# Altium project 2002_CapteurMeteoWifi.PrjPcb
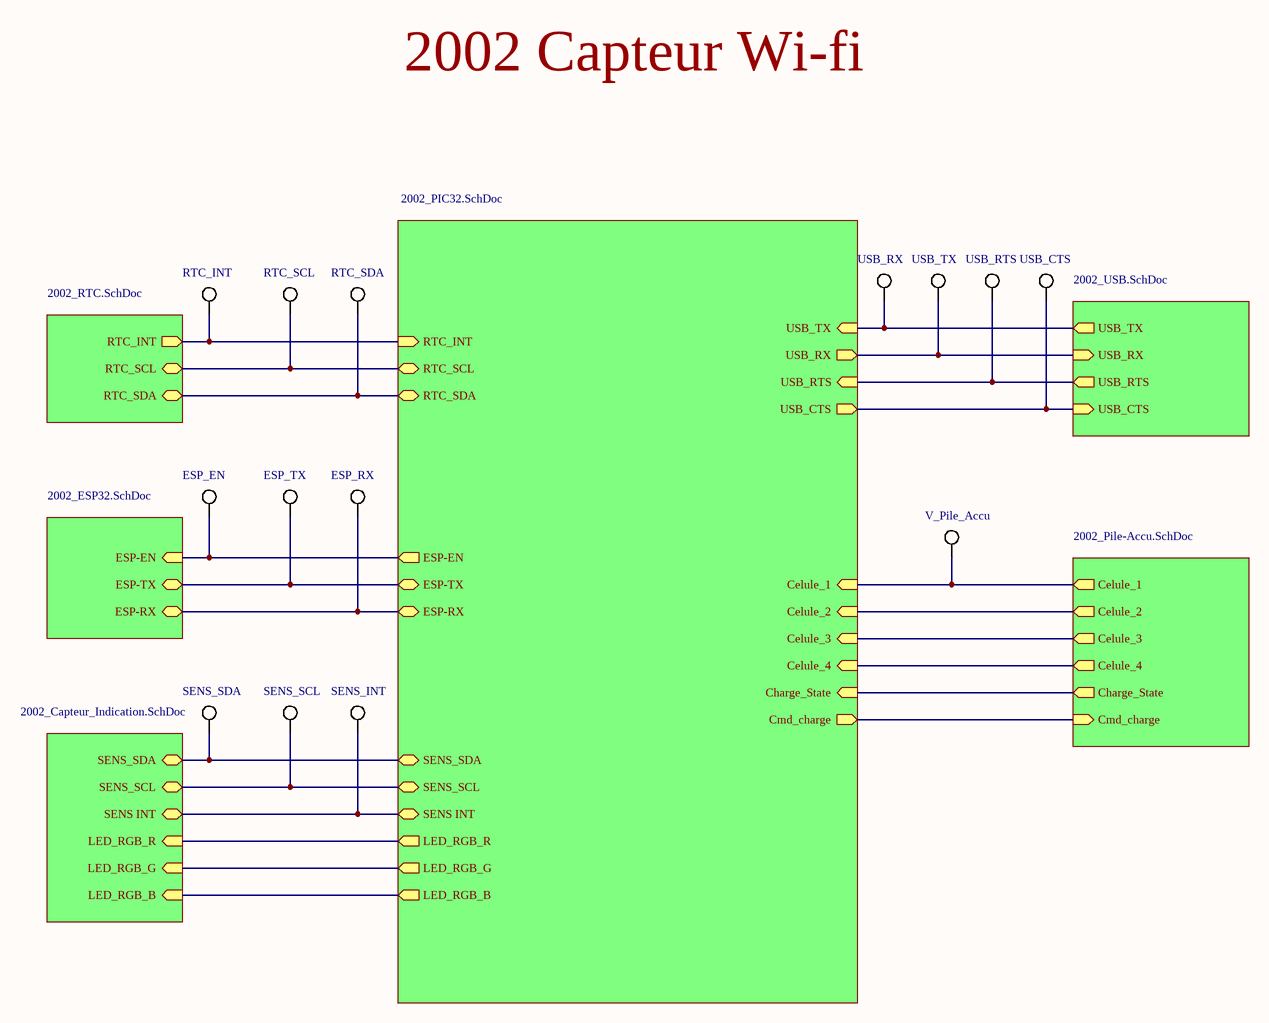
[diagram p0: 2002_SchemaBloc.SchDoc]
7 sheets, 88 parts. Net scope: hierarchical (ports join the sheet entries above them; power ports are global).
Board file: ES_PCB_6C_2L_2023.PcbDoc
Sheets:
  2002_SchemaBloc.SchDoc
    Puissance = 2002_USB.SchDoc
    Microcontrôleur = 2002_PIC32.SchDoc
    Ethernet = 2002_RTC.SchDoc
    Communication = 2002_Capteur_Indication.SchDoc
    ESP32 = 2002_ESP32.SchDoc
    Puissance = 2002_Pile-Accu.SchDoc

## Sheet 2002_SchemaBloc.SchDoc
size A3; Author: Joao Marques Chaves; Organization: ETML-ES; Address1: Avenue Recordon 1; Address2: 1004 Lausanne; Address3: Switzerland; SheetNumber: 1; SheetTotal: 7; Version: C

### Parts
ESP_EN  5019  [TESTPOINT_SMD]  (value not drawn)
ESP_RX  5019  [TESTPOINT_SMD]  (value not drawn)
ESP_TX  5019  [TESTPOINT_SMD]  (value not drawn)
RTC_INT  5019  [TESTPOINT_SMD]  (value not drawn)
RTC_SCL  5019  [TESTPOINT_SMD]  (value not drawn)
RTC_SDA  5019  [TESTPOINT_SMD]  (value not drawn)
SENS_INT  5019  [TESTPOINT_SMD]  (value not drawn)
SENS_SCL  5019  [TESTPOINT_SMD]  (value not drawn)
SENS_SDA  5019  [TESTPOINT_SMD]  (value not drawn)
USB_CTS  5019  [TESTPOINT_SMD]  (value not drawn)
USB_RTS  5019  [TESTPOINT_SMD]  (value not drawn)
USB_RX  5019  [TESTPOINT_SMD]  (value not drawn)
USB_TX  5019  [TESTPOINT_SMD]  (value not drawn)
V_Pile_Accu  5019  [TESTPOINT_SMD]  (value not drawn)

### Sub-sheets
Communication = 2002_Capteur_Indication.SchDoc: SENS_SDA (bidir), SENS_SCL (bidir), LED_RGB_R (in), LED_RGB_G (in), LED_RGB_B (in), SENS INT (bidir)
ESP32 = 2002_ESP32.SchDoc: ESP-RX (bidir), ESP-EN (in), ESP-TX (bidir)
Ethernet = 2002_RTC.SchDoc: RTC_SCL (bidir), RTC_SDA (bidir), RTC_INT (out)
Microcontrôleur = 2002_PIC32.SchDoc: RTC_SCL (bidir), RTC_SDA (bidir), ESP-EN (out), ESP-TX (bidir), ESP-RX (bidir), SENS_SDA (bidir), SENS_SCL (bidir), SENS INT (bidir), LED_RGB_R (out), LED_RGB_G (out), LED_RGB_B (out), USB_RX (out), USB_TX (in), USB_RTS (in), USB_CTS (out), Celule_1 (in), Celule_2 (in), Celule_3 (in), Celule_4 (in), RTC_INT (in), Charge_State (in), Cmd_charge (out)
Puissance = 2002_USB.SchDoc: USB_TX (out), USB_RX (in), USB_RTS (out), USB_CTS (in)
Puissance = 2002_Pile-Accu.SchDoc: Celule_1 (out), Celule_2 (out), Celule_3 (out), Celule_4 (out), Charge_State (out), Cmd_charge (in)

### Nets
Celule_1: V_Pile_Accu.1 ; sheet Microcontrôleur/Celule_1, sheet Puissance/Celule_1
Celule_2: sheet Microcontrôleur/Celule_2, sheet Puissance/Celule_2
Celule_3: sheet Microcontrôleur/Celule_3, sheet Puissance/Celule_3
Celule_4: sheet Microcontrôleur/Celule_4, sheet Puissance/Celule_4
Charge_State: sheet Microcontrôleur/Charge_State, sheet Puissance/Charge_State
Cmd_charge: sheet Microcontrôleur/Cmd_charge, sheet Puissance/Cmd_charge
ESP-EN: ESP_EN.1 ; sheet Microcontrôleur/ESP-EN, sheet ESP32/ESP-EN
ESP-RX: ESP_RX.1 ; sheet Microcontrôleur/ESP-RX, sheet ESP32/ESP-RX
ESP-TX: ESP_TX.1 ; sheet Microcontrôleur/ESP-TX, sheet ESP32/ESP-TX
LED_RGB_B: sheet Microcontrôleur/LED_RGB_B, sheet Communication/LED_RGB_B
LED_RGB_G: sheet Microcontrôleur/LED_RGB_G, sheet Communication/LED_RGB_G
LED_RGB_R: sheet Microcontrôleur/LED_RGB_R, sheet Communication/LED_RGB_R
RTC_INT: RTC_INT.1 ; sheet Microcontrôleur/RTC_INT, sheet Ethernet/RTC_INT
RTC_SCL: RTC_SCL.1 ; sheet Microcontrôleur/RTC_SCL, sheet Ethernet/RTC_SCL
RTC_SDA: RTC_SDA.1 ; sheet Microcontrôleur/RTC_SDA, sheet Ethernet/RTC_SDA
SENS INT: SENS_INT.1 ; sheet Microcontrôleur/SENS INT, sheet Communication/SENS INT
SENS_SCL: SENS_SCL.1 ; sheet Microcontrôleur/SENS_SCL, sheet Communication/SENS_SCL
SENS_SDA: SENS_SDA.1 ; sheet Microcontrôleur/SENS_SDA, sheet Communication/SENS_SDA
USB_CTS: USB_CTS.1 ; sheet Puissance/USB_CTS, sheet Microcontrôleur/USB_CTS
USB_RTS: USB_RTS.1 ; sheet Puissance/USB_RTS, sheet Microcontrôleur/USB_RTS
USB_RX: USB_TX.1 ; sheet Puissance/USB_RX, sheet Microcontrôleur/USB_RX
USB_TX: USB_RX.1 ; sheet Puissance/USB_TX, sheet Microcontrôleur/USB_TX

### Notes on the sheet
- 2002 Capteur Wi-fi
- Fichier :
- a
- Date :
- Heure :
- Version :
- Auteur :
- Modif.
- b
- c
- d
- Projet :
- No :
- Nb feuilles
- Feuille n°
- Chemin :

### Library data of the parts
ESP_EN ESP_RX ESP_TX RTC_INT RTC_SCL RTC_SDA SENS_INT SENS_SCL SENS_SDA USB_CTS USB_RTS USB_RX USB_TX V_Pile_Accu = TESTPOINT: Test point smd

## Sheet 2002_USB.SchDoc
size A3; Author: Joao Marques Chaves; Organization: ETML-ES; Address1: Avenue Recordon 1; Address2: 1004 Lausanne; Address3: Switzerland; SheetNumber: 2; SheetTotal: 7; Version: C
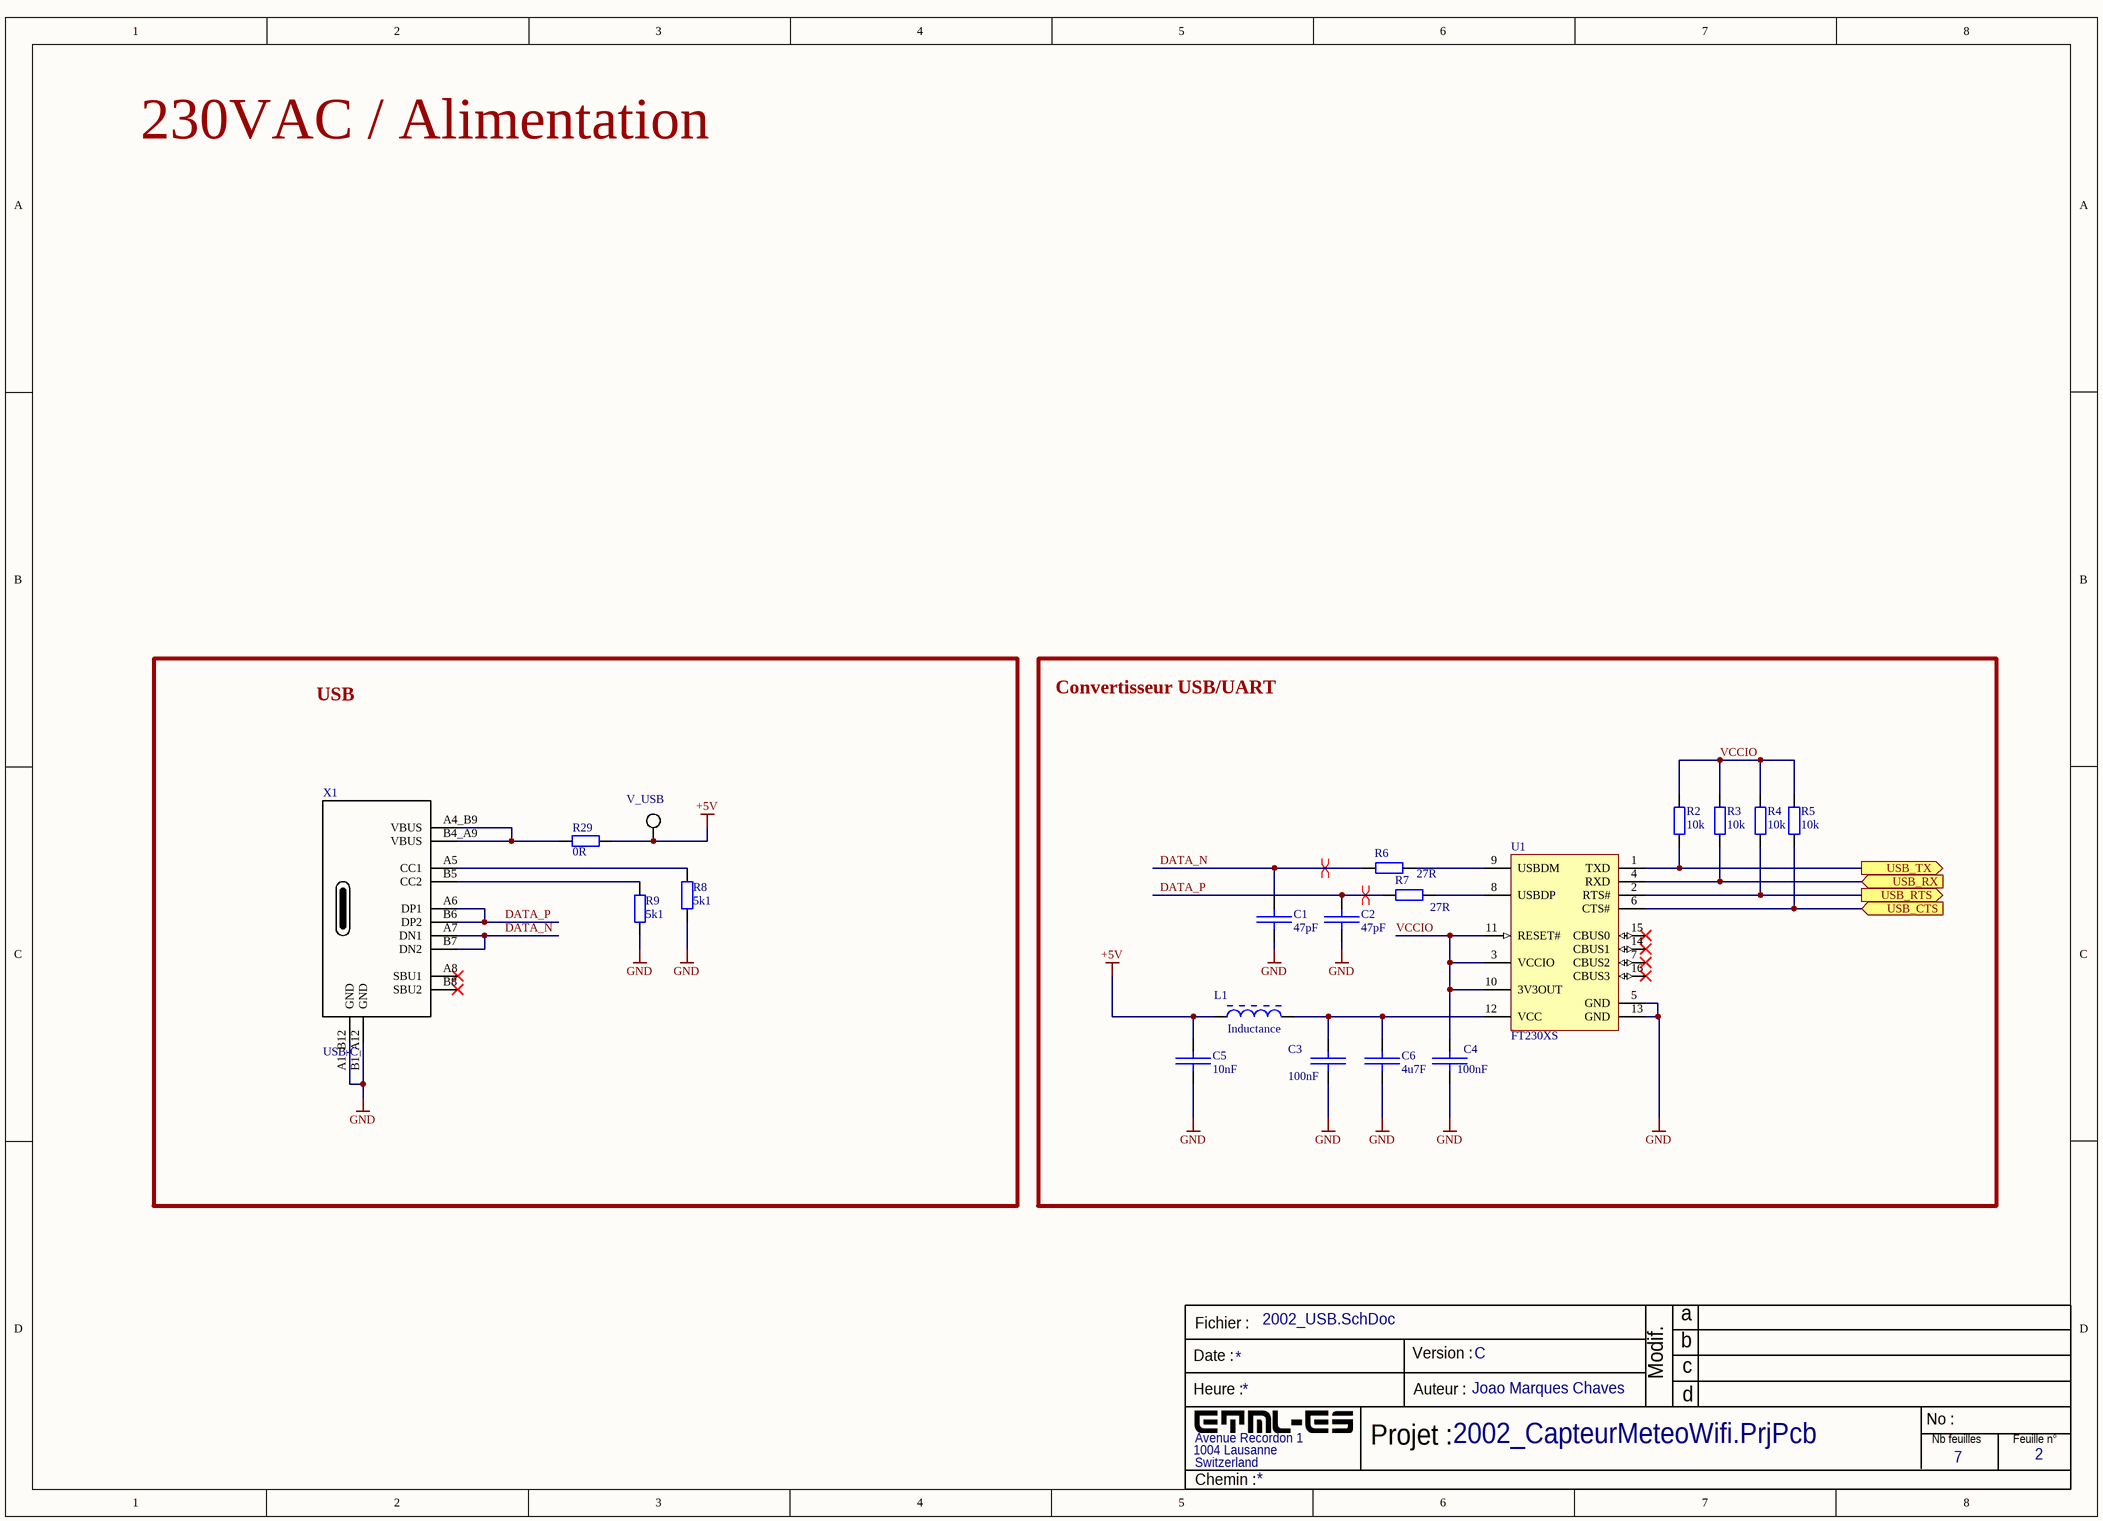
[diagram p1: 2002_USB.SchDoc]

### Parts
C1  47pF  [0805]
C2  47pF  [0805]
C3  100nF  [0805]
C4  100nF  [0805]
C5  10nF  [0805]
C6  4u7F  [0805]
L1  Inductance  [FB_MI0805K601R-10]
R2  10k  [0805]
R3  10k  [0805]
R4  10k  [0805]
R5  10k  [0805]
R6  27R  [0805]
R7  27R  [0805]
R8  5k1  [0805]
R9  5k1  [0805]
R29  0R  [0805]
U1  FT230XS  [FTDI-SSOP-16_L]
V_USB  5019  [TESTPOINT_SMD]  (value not drawn)
X1  USB-C  [GCT_USB4105-GF-A]

### Blocks framed on the sheet
USB: R8 R9 R29 V_USB X1
Convertisseur USB/UART: C1-C6 L1 R2-R7 U1

### Ports
USB_CTS (in), USB_RTS (out), USB_RX (in), USB_TX (out)

### Nets
+5V: C5.1 L1.1 R29.2 V_USB.1
GND: C1.2 C2.2 C3.2 C4.2 C5.2 C6.2 R8.1 R9.1 U1.5(GND) U1.13(GND) X1.A1_B12(GND) X1.B1_A12(GND)
DATA_N: C1.1 R6.1 X1.A7(DN1) X1.B7(DN2)
DATA_P: C2.1 R7.1 X1.A6(DP1) X1.B6(DP2)
USB_CTS: R5.1 U1.6(CTS#) ; port USB_CTS
USB_RTS: R4.1 U1.2(RTS#) ; port USB_RTS
USB_RX: R3.1 U1.4(RXD) ; port USB_RX
USB_TX: R2.1 U1.1(TXD) ; port USB_TX
VCCIO: C4.1 R2.2 R3.2 R4.2 R5.2 U1.3(VCCIO) U1.10(3V3OUT) U1.11(RESET#)
NetC3_1: C3.1 C6.1 L1.2 U1.12(VCC)
NetR6_2: R6.2 U1.9(USBDM)
NetR7_2: R7.2 U1.8(USBDP)
NetR8_2: R8.2 X1.A5(CC1)
NetR9_2: R9.2 X1.B5(CC2)
NetR29_1: R29.1 X1.A4_B9(VBUS) X1.B4_A9(VBUS)

Not connected (* = marked no-connect by the designer): U1 7(CBUS2)* 14(CBUS1)* 15(CBUS0)* 16(CBUS3)*; X1 A8(SBU1)* B8(SBU2)*

### Layout directives
differential pair: DATA_N, DATA_P

### Notes on the sheet
- 230VAC / Alimentation
- Fichier :
- a
- Date :
- Heure :
- Version :
- Auteur :
- Modif.
- b
- c
- d
- Projet :
- No :
- Nb feuilles
- Feuille n°
- Chemin :

### Library data of the parts
C1 C2 = Condensator: Value: 47pF
C3-C6 = Condensator: 0805 Condensator
  C3 C4: Value: 100nF
  C5: Value: 10nF
  C6: Value: 4u7F
L1 = CMP-2000-05196-1: MI0805K601R-10; Manufacturer: Laird; Filter Type: PowerLine; Current Rating (Max): 1.5A; Catalog Drawings: (HI,HZ,LI,MI)0805Series_1.10mmMax.Height; Impedance @ Frequency: 600Ohm@100MHz; Number of Lines: 1; DC Resistance (DCR) (Max): 100mOhm; Other Names: 240-2390-1; Kits: 240-2227-ND-KITEMIFERRITEBEADCHIPSMD; Online Catalog: MISeries; Standard Package: 1; Datasheet Version: Rev. A, 01/2004; Height (Max): 0.043"(1.10mm); Category: Filters; Operating Temperature: -40degC~125degC; Package Description: 2-Pin Surface Mount Device, Body 2 x 1.25 mm; Package / Case: 0805(2012Metric); Package Reference: MI0805K601R-10-2; Packaging: CutTape(CT); Ratings: -; Mounting Type: SurfaceMount; Datasheet URL: https://datasheet.ciiva.com/3082/mi0805k601r-10-a-vp-3082219.pdf; Size / Dimension: 0.079"Lx0.049"W(2.00mmx1.25mm); Family: FerriteBeadsandChips; Manufacturer URL: https://www.lairdtech.com; Series: MI; Supplier: Digikey; Supplier Ref.: 240-2390-1-ND; Supplier min. qty: 1; Supplier unit price: 0.11; ComponentLink1Description: distributeur; ComponentLink1URL: https://eu.mouser.com/ProductDetail/Laird-Performance-Materials/MI0805K601R-10?qs=bbdZqDPQhEXXIHxc191aOg%3D%3D; ComponentLink2Description: Datasheet; ComponentLink2URL: https://eu.mouser.com/datasheet/2/987/mi0805k601r_10_datasheet-2947150.pdf
R2-R5 = RES-0805: SMD Resistor; Resistance: 10k
R6 R7 = RES-0805: SMD Resistor 0805, 330Ω; Resistance: 27R
R8 R9 = CMP-2001-00528-1: Part Number: ERJ6ENF2703V; Manufacturer: Panasonic
R29 = Res2_1: Resistor; Published: 8-Jun-2000; LatestRevisionDate: 17-Jul-2002; LatestRevisionNote: Re-released for DXP Platform.; PackageReference: AXIAL-0.4; Publisher: Altium Limited; PackageDescription: Axial Device, Thru-Hole; 2 Leads; 0.4 in Pin Spacing; Value: 0R
U1 = CMP-2000-06288-1: USB to Basic UART IC, 2.97 to 5.5 V, -40 to 85 degC, 16-Pin SSOP, RoHS; Manufacturer: FTDI; Data Rate: 3Mbaud; USB Standard: USB2.0; USB Type: Transceiver; No. of Pins: 16Pins; Supply Voltage Max: 5.5V; SVHC: NoSVHC(17-Dec-2015); Supply Voltage Min: 2.97V; MSL: MSL3-168hours; Datasheet Version: Rev. 1.4, 05/2016; Interface Case Style: SSOP; Datasheet URL: http://www.ftdichip.com/Support/Documents/DataSheets/ICs/DS_FT230X.pdf; Packaging: CutTape; Package Description: 16-Pin Shrink Small Outline Package Integrated Circuit, Body 4.9 x 3.9 mm, Pitch 0.635 mm; Operating Temperature Min: -40°C; Mounting Technology: SurfaceMount; Package Reference: SSOP-16; Manufacturer URL: http://www.ftdichip.com/; Product Range: -; Operating Temperature Max: 85°C; No. of Ports: -; Supplier: Digikey; Supplier Ref.: 768-1135-1-ND; Supplier min. qty: 1; Supplier unit price: 2.00; ComponentLink1Description: distributeur; ComponentLink1URL: https://www.mouser.ch/ProductDetail/FTDI/FT230XS-R?qs=Gp1Yz1mis3XyCLeYOseSng%3D%3D; ComponentLink2Description: Datasheet; ComponentLink2URL: https://www.mouser.ch/datasheet/2/163/DS_FT230X-5395.pdf
V_USB = TESTPOINT: Test point smd
X1 = USB-C Type 2.0: U262-161N-4BVC11; ComponentLink1Description: LCSC  C319148; ComponentLink1URL: https://lcsc.com/product-detail/USB-Connectors_XKB-Connectivity-U262-161N-4BVC11_C319148.html; Supplier 1: LCSC; Supplier Part Number 1: C319148; ComponentLink2Description: Datasheet; ComponentLink2URL: https://eu.mouser.com/datasheet/2/837/Global_Connector_Technology_usb4105-3106202.pdf; ComponentLink3Description: distributeur; ComponentLink3URL: https://eu.mouser.com/ProductDetail/GCT/USB4105-GF-A?qs=KUoIvG%2F9IlY%2FMLlBMpStpA%3D%3D

## Sheet 2002_PIC32.SchDoc
size A3; Author: Joao Marques Chaves; Organization: ETML-ES; Address1: Avenue Recordon 1; Address2: 1004 Lausanne; Address3: Switzerland; SheetNumber: 4; SheetTotal: 7; Version: C
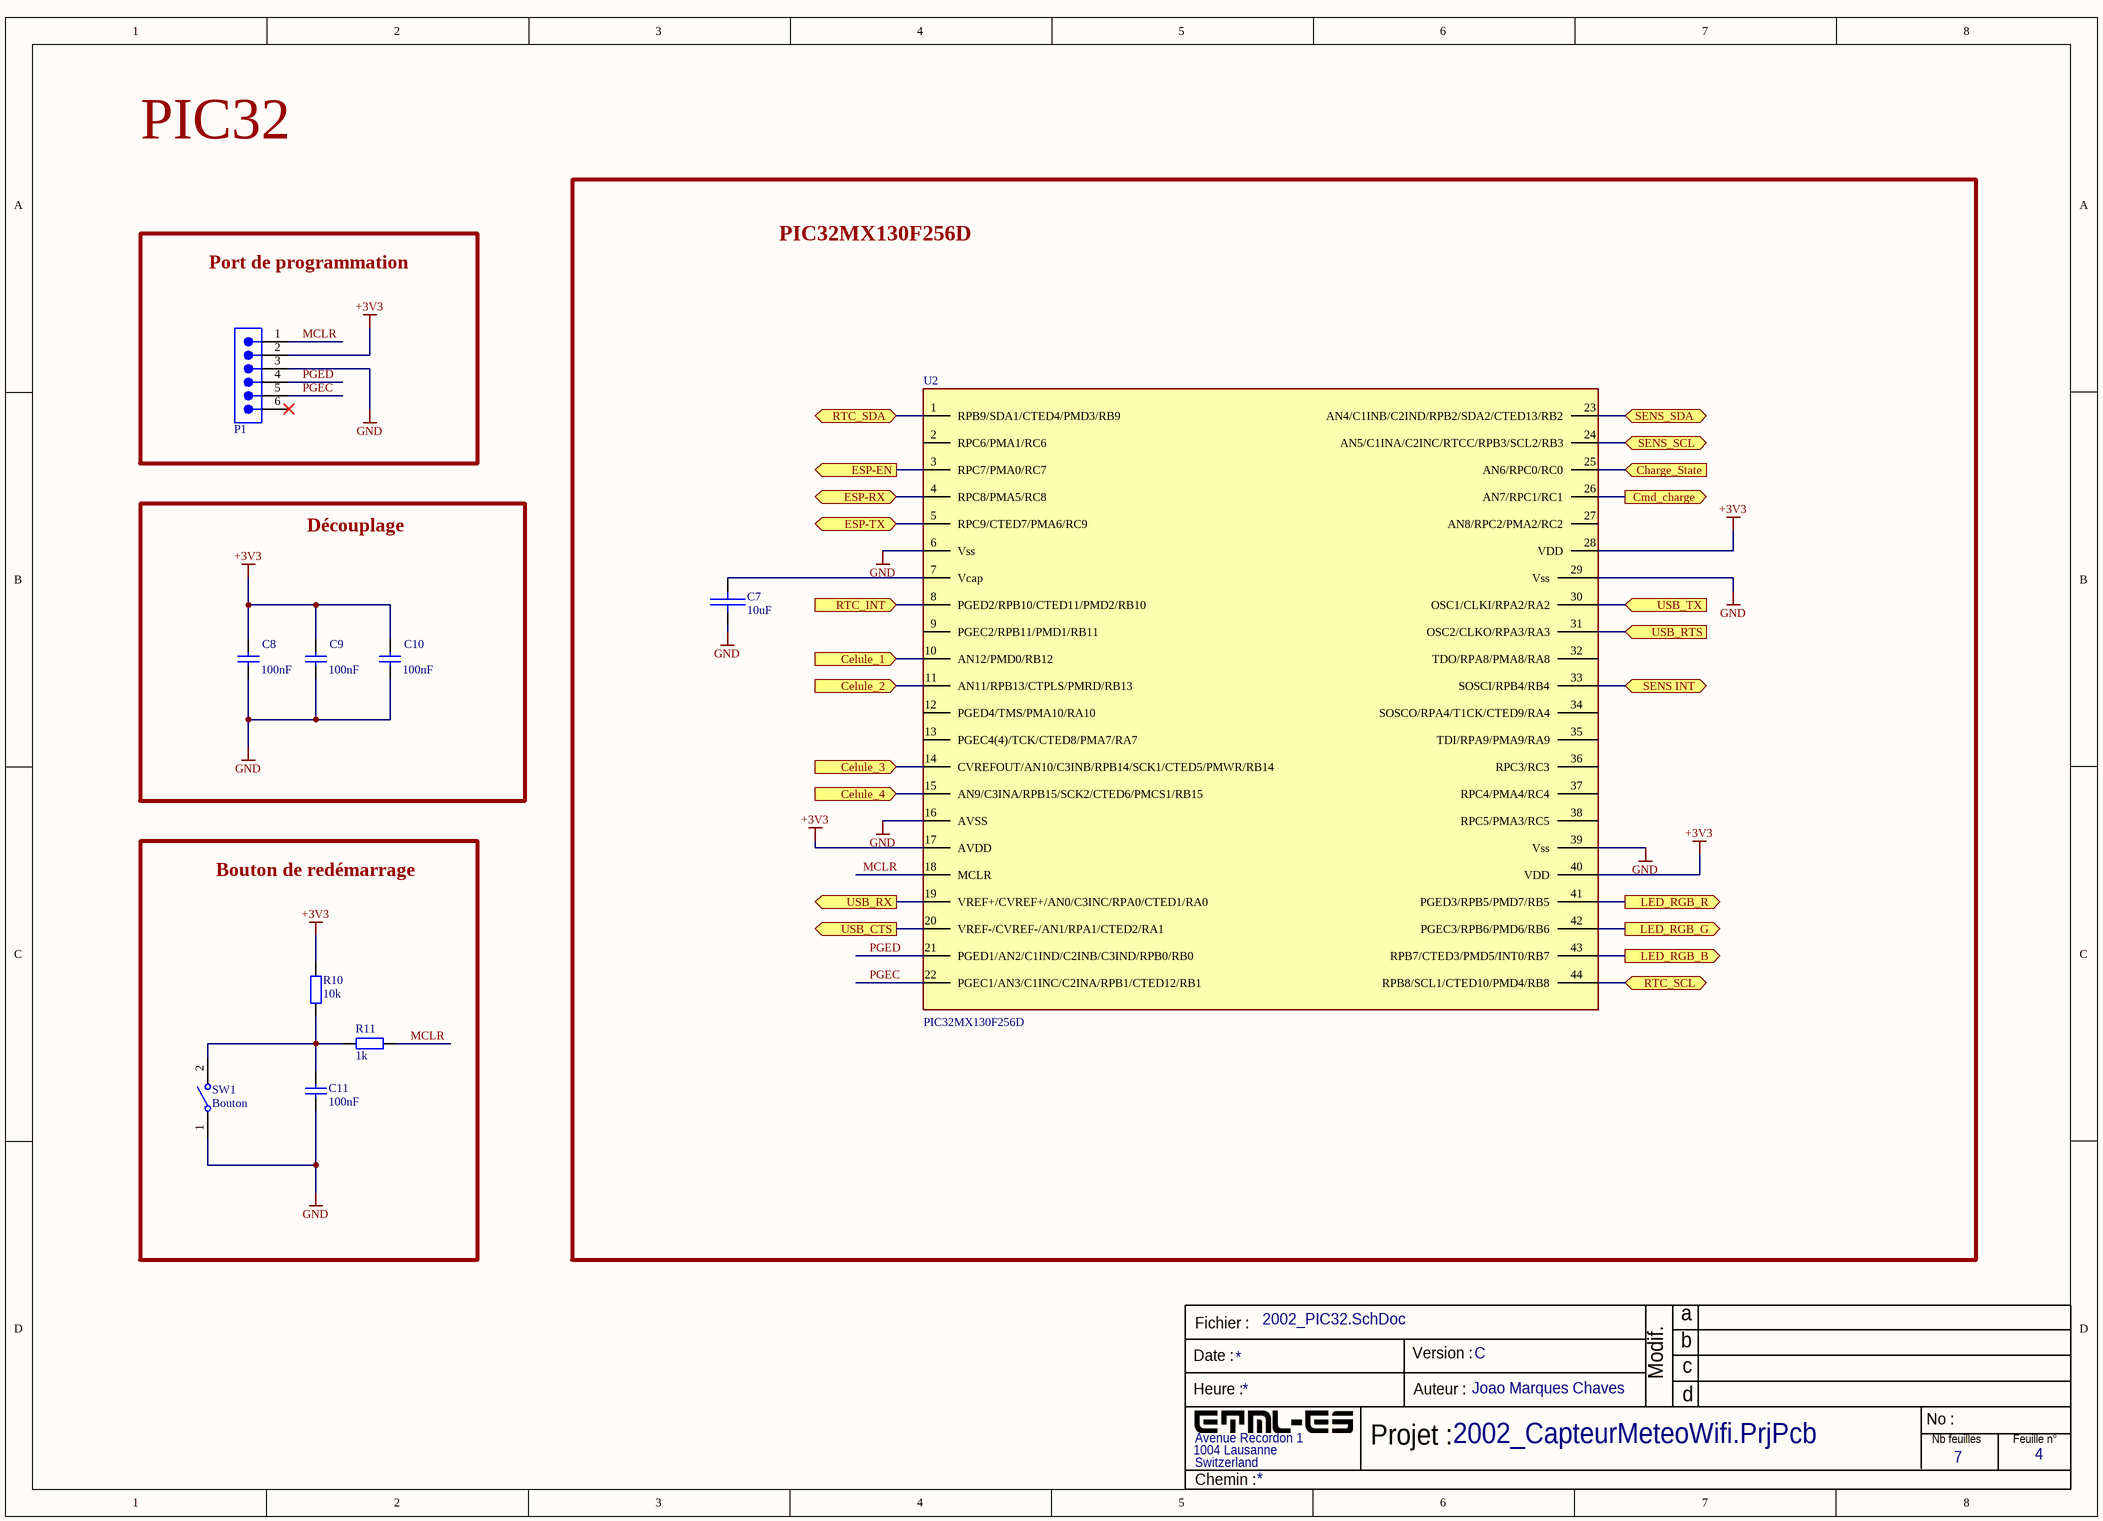
[diagram p2: 2002_PIC32.SchDoc]

### Parts
C7  10uF  [0805]
C8  100nF  [0805]
C9  100nF  [0805]
C10  100nF  [0805]
C11  100nF  [0805]
P1  6 Pin header  [conecteur 1x6]  (value not drawn)
R10  10k  [0805]
R11  1k  [0805]
SW1  Bouton  [Switch]
U2  PIC32MX130F256D  [PIC32MX130F256D-I/PT]

### Blocks framed on the sheet
PIC32MX130F256D: C7 U2
Port de programmation: P1
Découplage: C8-C10
Bouton de redémarrage: C11 R10 R11 SW1

### Ports
Celule_1 (in), Celule_2 (in), Celule_3 (in), Celule_4 (in), Charge_State (in), Cmd_charge (out), ESP-EN (out), ESP-RX (bidir), ESP-TX (bidir), LED_RGB_B (out), LED_RGB_G (out), LED_RGB_R (out), RTC_INT (in), RTC_SCL (bidir), RTC_SDA (bidir), SENS INT (bidir), SENS_SCL (bidir), SENS_SDA (bidir), USB_CTS (out), USB_RTS (in), USB_RX (out), USB_TX (in)

### Nets
+3V3: C8.2 C9.2 C10.2 P1.2 R10.1 U2.17(AVDD) U2.28(VDD) U2.40(VDD)
GND: C7.2 C8.1 C9.1 C10.1 C11.2 P1.3 SW1.1 U2.6(Vss) U2.16(AVSS) U2.29(Vss) U2.39(Vss)
Celule_1: U2.10(AN12/PMD0/RB12) ; port Celule_1
Celule_2: U2.11(AN11/RPB13/CTPLS/PMRD/RB13) ; port Celule_2
Celule_3: U2.14(CVREFOUT/AN10/C3INB/RPB14/SCK1/CTED5/PMWR/RB14) ; port Celule_3
Celule_4: U2.15(AN9/C3INA/RPB15/SCK2/CTED6/PMCS1/RB15) ; port Celule_4
Charge_State: U2.25(AN6/RPC0/RC0) ; port Charge_State
Cmd_charge: U2.26(AN7/RPC1/RC1) ; port Cmd_charge
ESP-EN: U2.3(RPC7/PMA0/RC7) ; port ESP-EN
ESP-RX: U2.4(RPC8/PMA5/RC8) ; port ESP-RX
ESP-TX: U2.5(RPC9/CTED7/PMA6/RC9) ; port ESP-TX
LED_RGB_B: U2.43(RPB7/CTED3/PMD5/INT0/RB7) ; port LED_RGB_B
LED_RGB_G: U2.42(PGEC3/RPB6/PMD6/RB6) ; port LED_RGB_G
LED_RGB_R: U2.41(PGED3/RPB5/PMD7/RB5) ; port LED_RGB_R
MCLR: P1.1 R11.2 U2.18(MCLR)
PGEC: P1.5 U2.22(PGEC1/AN3/C1INC/C2INA/RPB1/CTED12/RB1)
PGED: P1.4 U2.21(PGED1/AN2/C1IND/C2INB/C3IND/RPB0/RB0)
RTC_INT: U2.8(PGED2/RPB10/CTED11/PMD2/RB10) ; port RTC_INT
RTC_SCL: U2.44(RPB8/SCL1/CTED10/PMD4/RB8) ; port RTC_SCL
RTC_SDA: U2.1(RPB9/SDA1/CTED4/PMD3/RB9) ; port RTC_SDA
SENS INT: U2.33(SOSCI/RPB4/RB4) ; port SENS INT
SENS_SCL: U2.24(AN5/C1INA/C2INC/RTCC/RPB3/SCL2/RB3) ; port SENS_SCL
SENS_SDA: U2.23(AN4/C1INB/C2IND/RPB2/SDA2/CTED13/RB2) ; port SENS_SDA
USB_CTS: U2.20(VREF-/CVREF-/AN1/RPA1/CTED2/RA1) ; port USB_CTS
USB_RTS: U2.31(OSC2/CLKO/RPA3/RA3) ; port USB_RTS
USB_RX: U2.19(VREF+/CVREF+/AN0/C3INC/RPA0/CTED1/RA0) ; port USB_RX
USB_TX: U2.30(OSC1/CLKI/RPA2/RA2) ; port USB_TX
NetC7_1: C7.1 U2.7(Vcap)
NetC11_1: C11.1 R10.2 R11.1 SW1.2

Not connected (* = marked no-connect by the designer): P1 6*; U2 2(RPC6/PMA1/RC6) 9(PGEC2/RPB11/PMD1/RB11) 12(PGED4/TMS/PMA10/RA10) 13(PGEC4(4)/TCK/CTED8/PMA7/RA7) 27(AN8/RPC2/PMA2/RC2) 32(TDO/RPA8/PMA8/RA8) 34(SOSCO/RPA4/T1CK/CTED9/RA4) 35(TDI/RPA9/PMA9/RA9) 36(RPC3/RC3) 37(RPC4/PMA4/RC4) 38(RPC5/PMA3/RC5)

### Notes on the sheet
- PIC32
- Fichier :
- a
- Date :
- Heure :
- Version :
- Auteur :
- Modif.
- b
- c
- d
- Projet :
- No :
- Nb feuilles
- Feuille n°
- Chemin :

### Library data of the parts
C7 = Condensator: 0805 Condensator; Value: 10uF
C8-C11 = 885012207016: Capacitor smd; Manufacturer: Wurth Elektronik; Match Code: WCAP-CSGP; Capacitance Tolerance: +/-10%; Ceramic Type: X7R; Dissipation Factor: 5%; Insulation Resistance: 5GΩ; Rated Voltage (DC): 10V; Technical Reference: X7R0805104K010DFCT10000; Manufacturer Part Number: 885012207016; Category: Multilayer Ceramic Chip Capacitors; ComponentLink1Description: Website Link; ComponentLink1URL: https://www.we-online.com/redexpert/article/885012207016?ad; ComponentLink2Description: Datasheet Link; ComponentLink2URL: https://www.we-online.com/redexpert/spec/885012207016?ad; Mount: Surface Mount; Operating Temperature Max: 125°C; Operating Temperature Min: -55°C; Packaging: Tape and Reel; Case/Size Code: 0805; Length: 2mm; Width: 1.25mm; Height: 0.8mm; Capacitance: 100nF
P1 = 61300611121: WR-PHD Pin Header, THT, Vertical, pitch 2.54mm, 1 Row, 6P; Manufacturer: Wurth Elektronik; Contact Resistance: 20mΩ; Rated Current: 3A; Working Voltage: 250V; Withstanding Voltage: 500V; ComponentLink1Description: Website Link; ComponentLink1URL: https://www.we-online.com/redexpert/article/61300611121?ad; ComponentLink2Description: Datasheet Link; ComponentLink2URL: https://www.we-online.com/redexpert/spec/61300611121?ad; Manufacturer Part Number: 61300611121; Category: Board-to-Board Connectors; Match Code: WR-PHD; Mount: Through Hole; Operating Temperature Max: 105°C; Operating Temperature Min: -40°C; Packaging: Bag; Gender: Pin Header; Number of Pins: 6; Number of Rows: 1; Orientation: Vertical; Pitch: 2.54mm; ComponentLink3Description: distributeur; ComponentLink3URL: https://eu.mouser.com/ProductDetail/Wurth-Elektronik/61300611121?qs=t4813l51qx%2FRpdf0Kp1HlQ%3D%3D; ComponentLink4Description: Datasheet; ComponentLink4URL: https://www.we-online.com/components/products/datasheet/61300611121.pdf
R10 R11 = RES-0805: SMD Resistor
  R10: Resistance: 10k
  R11: Resistance: 1k
SW1 = 434121050836: Tactile Switches WS-TASV Tact Switch; Manufacturer: Wurth Elektronik; Circuit: SPST-NO; Operation Force: 360g; Rated Current: 50mA; Rated Voltage (DC): 12V; Washable: No; Manufacturer Part Number: 434121050836; Category: Tact Switches; Match Code: WS-TASV; ComponentLink1Description: Website Link; ComponentLink1URL: https://www.we-online.com/redexpert/article/434121050836?ad; ComponentLink2Description: Datasheet Link; ComponentLink2URL: https://www.we-online.com/redexpert/spec/434121050836?ad; Mount: Surface Mount; Operating Temperature Max: 85°C; Operating Temperature Min: -40°C; Packaging: Tape and Reel; Length: 6mm; Width: 3.5mm; Height: 5mm; Contact Material: Stainless Steel; Contact Plating: Silver; Terminal Material: Copper Alloy; Terminal Plating: Silver; ComponentLink3Description: distributeur; ComponentLink3URL: https://eu.mouser.com/ProductDetail/Wurth-Elektronik/434121050836?qs=wr8lucFkNMVxMSmJWja3%2Fg%3D%3D; ComponentLink4Description: Datasheet; ComponentLink4URL: https://www.we-online.com/components/products/datasheet/434121050836.pdf
U2 = PIC32MX130F256B-I_SS: Integrated Circuit; Manufacturer_Name: Microchip; Manufacturer_Part_Number: PIC32MX130F256D-50I/PT; Datasheet: https://www.mouser.ch/datasheet/2/268/PIC32MX1XX2XX283644_PIN_Datasheet_DS60001168L-3443206.pdf; Height: 2mm; Mouser Part Number: 579-MX130F256D50IPT; Mouser Price/Stock: https://www.mouser.com/Search/Refine.aspx?Keyword=579-MX130F256BISS; RS Part Number: 8806720P; RS Price/Stock: http://uk.rs-online.com/web/p/products/8806720P; ComponentLink1Description: distributeur; ComponentLink1URL: https://eu.mouser.com/ProductDetail/Microchip-Technology/PIC32MX130F256D-50I-PT?qs=XR%2FfMt4sL%252BEAZuPDxF6NKQ%3D%3D

## Sheet 2002_RTC.SchDoc
size A3; Author: Joao Marques Chaves; Organization: ETML-ES; Address1: Avenue Recordon 1; Address2: 1004 Lausanne; Address3: Switzerland; SheetNumber: 4; SheetTotal: 7; Version: C; SPICEModelCacheRYIINKWG: <root> / <DocumentId>RYIINKWG</DocumentId> / </root>
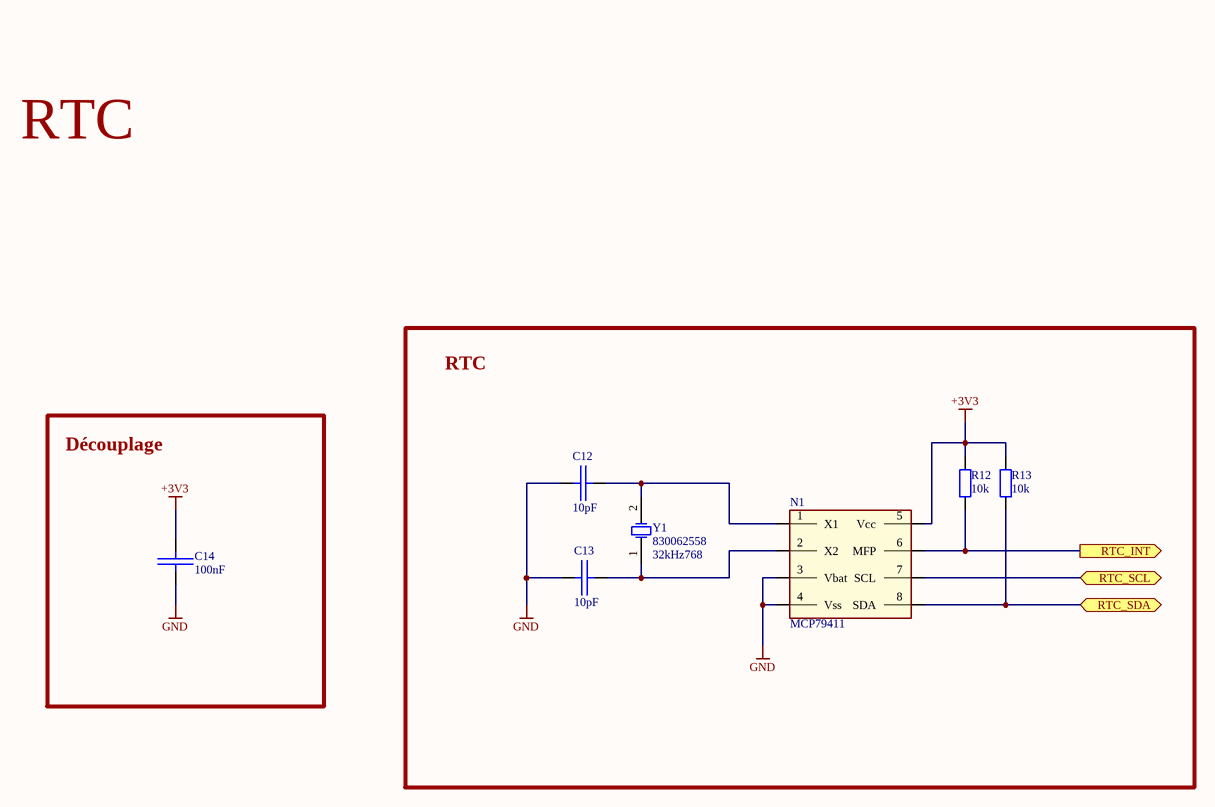
[diagram p3: 2002_RTC.SchDoc]

### Parts
C12  10pF  [0805]
C13  10pF  [0805]
C14  100nF  [0805]
N1  MCP79411  [MCP79411]
R12  10k  [0805]
R13  10k  [0805]
Y1  830062558  Frequency: 32kHz768  [WE-XTAL_IQXC-25]

### Blocks framed on the sheet
RTC: C12 C13 N1 R12 R13 Y1
Découplage: C14

### Ports
RTC_INT (out), RTC_SCL (bidir), RTC_SDA (bidir)

### Nets
+3V3: C14.1 N1.5(Vcc) R12.1 R13.1
GND: C12.1 C13.1 C14.2 N1.3(Vbat) N1.4(Vss)
RTC_INT: N1.6(MFP) R12.2 ; port RTC_INT
RTC_SCL: N1.7(SCL) ; port RTC_SCL
RTC_SDA: N1.8(SDA) R13.2 ; port RTC_SDA
NetC12_2: C12.2 N1.1(X1) Y1.2(OSC2)
NetC13_2: C13.2 N1.2(X2) Y1.1(OSC1)

### Notes on the sheet
- RTC
- Fichier :
- a
- Date :
- Heure :
- Version :
- Auteur :
- Modif.
- b
- c
- d
- Projet :
- No :
- Nb feuilles
- Feuille n°
- Chemin :

### Library data of the parts
C12-C14 = Condensator: 0805 Condensator
  C12 C13: Value: 10pF
  C14: Value: 100nF
N1 = MCP79411: RTC; ComponentLink1Description: distributeur; ComponentLink1URL: https://eu.mouser.com/ProductDetail/Microchip-Technology/MCP79411-I-MS?qs=ggQiQSXuoRWmeAUZm6kXJQ%3D%3D; ComponentLink2Description: Datasheet; ComponentLink2URL: https://eu.mouser.com/datasheet/2/268/MCP79410_MCP79411_MCP79412_Battery_Backed_I2C_RTCC-3359732.pdf
R12 R13 = CMP-2001-00528-1: SMD Resistor; Part Number: ERJ6ENF2703V; Manufacturer: Panasonic
Y1 = 830020423: Crystals WE-XTAL 32.7680kHz 20ppm 2.0 x 1.2mm; Manufacturer: Wurth Elektronik; Case/Size Code: HC49/4HSMX; Frequency Stability: +/-50ppm; Frequency Tolerance: +/-30ppm; Load Capacitance: 18pF; ComponentLink1Description: distributeur; ComponentLink1URL: https://eu.mouser.com/ProductDetail/Wurth-Elektronik/830062558?qs=2WXlatMagcGRj%2FV5lbTfrg%3D%3D; ComponentLink2Description: Datasheet; ComponentLink2URL: https://www.we-online.com/components/products/datasheet/830062558.pdf; Manufacturer Part Number: 830020423; Category: Crystals; Match Code: WE-XTAL; Mount: Surface Mount; Operating Temperature Max: 70°C; Operating Temperature Min: -20°C; Packaging: Tape and Reel; Length: 11.4mm; Width: 4.9mm; Height: 4.3mm

## Sheet 2002_Capteur_Indication.SchDoc
size A3; Author: Joao Marques Chaves; Organization: ETML-ES; Address1: Avenue Recordon 1; Address2: 1004 Lausanne; Address3: Switzerland; SheetNumber: 6; SheetTotal: 7; Version: C
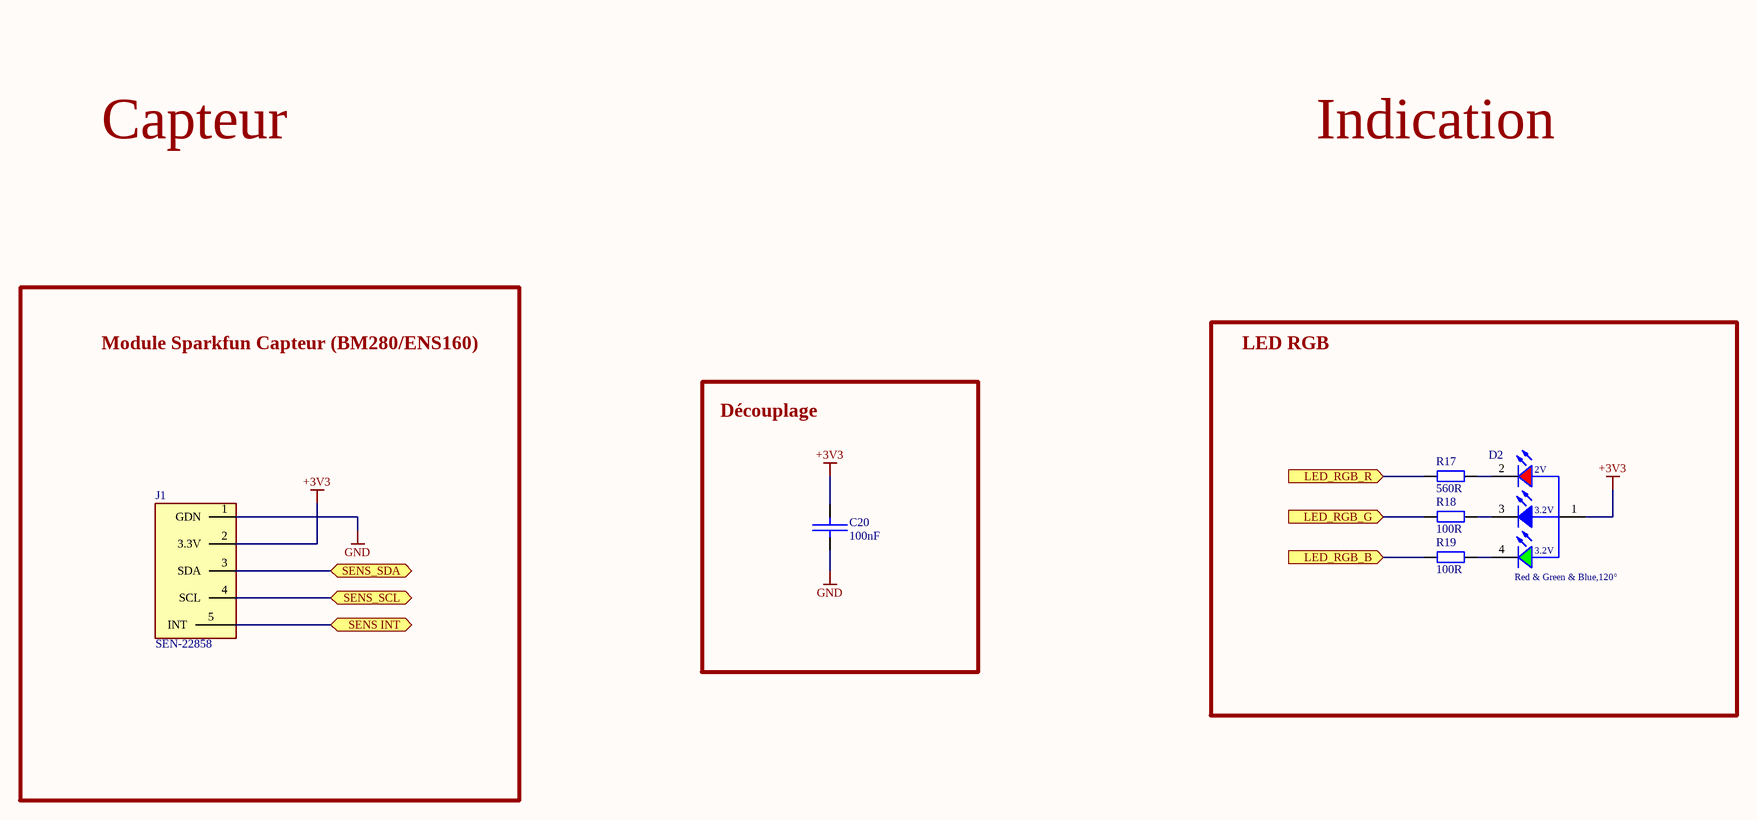
[diagram p4: 2002_Capteur_Indication.SchDoc]

### Parts
C20  100nF  [0805]
D2  Red & Green & Blue,120°  [LED_APHF1608LSEEQBDZGKC]
J1  SEN-22858  [SEN-22858]
R17  560R  [0805]
R18  100R  [0805]
R19  100R  [0805]

### Blocks framed on the sheet
Module Sparkfun Capteur (BM280/ENS160): J1
LED RGB: D2 R17-R19
Découplage: C20

### Ports
LED_RGB_B (in), LED_RGB_G (in), LED_RGB_R (in), SENS INT (bidir), SENS_SCL (bidir), SENS_SDA (bidir)

### Nets
+3V3: C20.1 D2.1 J1.2(3.3V)
GND: C20.2 J1.1(GDN)
LED_RGB_B: R19.1 ; port LED_RGB_B
LED_RGB_G: R18.1 ; port LED_RGB_G
LED_RGB_R: R17.1 ; port LED_RGB_R
SENS INT: J1.5(INT) ; port SENS INT
SENS_SCL: J1.4(SCL) ; port SENS_SCL
SENS_SDA: J1.3(SDA) ; port SENS_SDA
NetD2_2: D2.2(RED) R17.2
NetD2_3: D2.3(BLUE) R18.2
NetD2_4: D2.4(GREEN) R19.2

### Notes on the sheet
- Capteur
- Indication
- Fichier :
- a
- Date :
- Heure :
- Version :
- Auteur :
- Modif.
- b
- c
- d
- Projet :
- No :
- Nb feuilles
- Feuille n°
- Chemin :
- (in symbol APHF1608LSEEQBDZGKC) 2V; 3.2V

### Library data of the parts
C20 = Condensator: Capacitor smd; Value: 100nF
D2 = APHF1608LSEEQBDZGKC: DEL standard - CMS RGB 0603 SMD; Part Number: 150066M153000; Forward Voltage: 3.3 V@Blue, 3.3 V@Green, 2 V@Red; Peak Wavelength: 468 nm@Blue, 520 nm@Green, 632 nm@Red; Dominant Wavelength: 470 nm@Blue, 525 nm@Green, 624 nm@Red; Luminous Intensity: 180 mcd@Blue, 900 mcd@Green, 285 mcd@Red; ComponentLink1Description: Manufacturer; ComponentLink1URL: http://www.we-online.de; ComponentLink2Description: Datasheet; ComponentLink2URL: http://katalog.we-online.de/led/datasheet/150066M153000.pdf; Published Date: May 2018; Publisher: Wurth Elektronik; Size: 0606; Viewing Angle: 120°; Operating Temperature: -40 to 85 degC; Emitting Color: Red & Green & Blue; Mounting Technology: SMT
J1 = BME280/ENS160: Manufacturer_Name: Amphenol; Manufacturer_Part_Number: 68604-804HLF; Datasheet Link: https://componentsearchengine.com/Datasheets/1/68604-804HLF.pdf; Height: 12.39mm; Mouser2 Part Number: 649-68604-804HLF; Mouser2 Price/Stock: https://www.mouser.com/Search/Refine.aspx?Keyword=649-68604-804HLF; ComponentLink1Description: distributeur; ComponentLink1URL: https://www.digikey.ch/en/products/detail/sparkfun-electronics/SEN-22858/21679190?msockid=164a7d802847664138ed69fe294c67a6; ComponentLink2Description: Datasheet; ComponentLink2URL: https://docs.sparkfun.com/SparkFun_Environmental_Combo_Breakout_ENS160_BME280_QWIIC/assets/board_files/SparkFun_ENS160_BME280_Breakout_Schematic_V11.pdf
R17-R19 = RES-0805: SMD Resistor
  R17: Resistance: 560R
  R18 R19: Resistance: 100R

## Sheet 2002_ESP32.SchDoc
size A3; Author: Joao Marques Chaves; Organization: ETML-ES; Address1: Avenue Recordon 1; Address2: 1004 Lausanne; Address3: Switzerland; SheetNumber: 2; SheetTotal: 7; Version: C
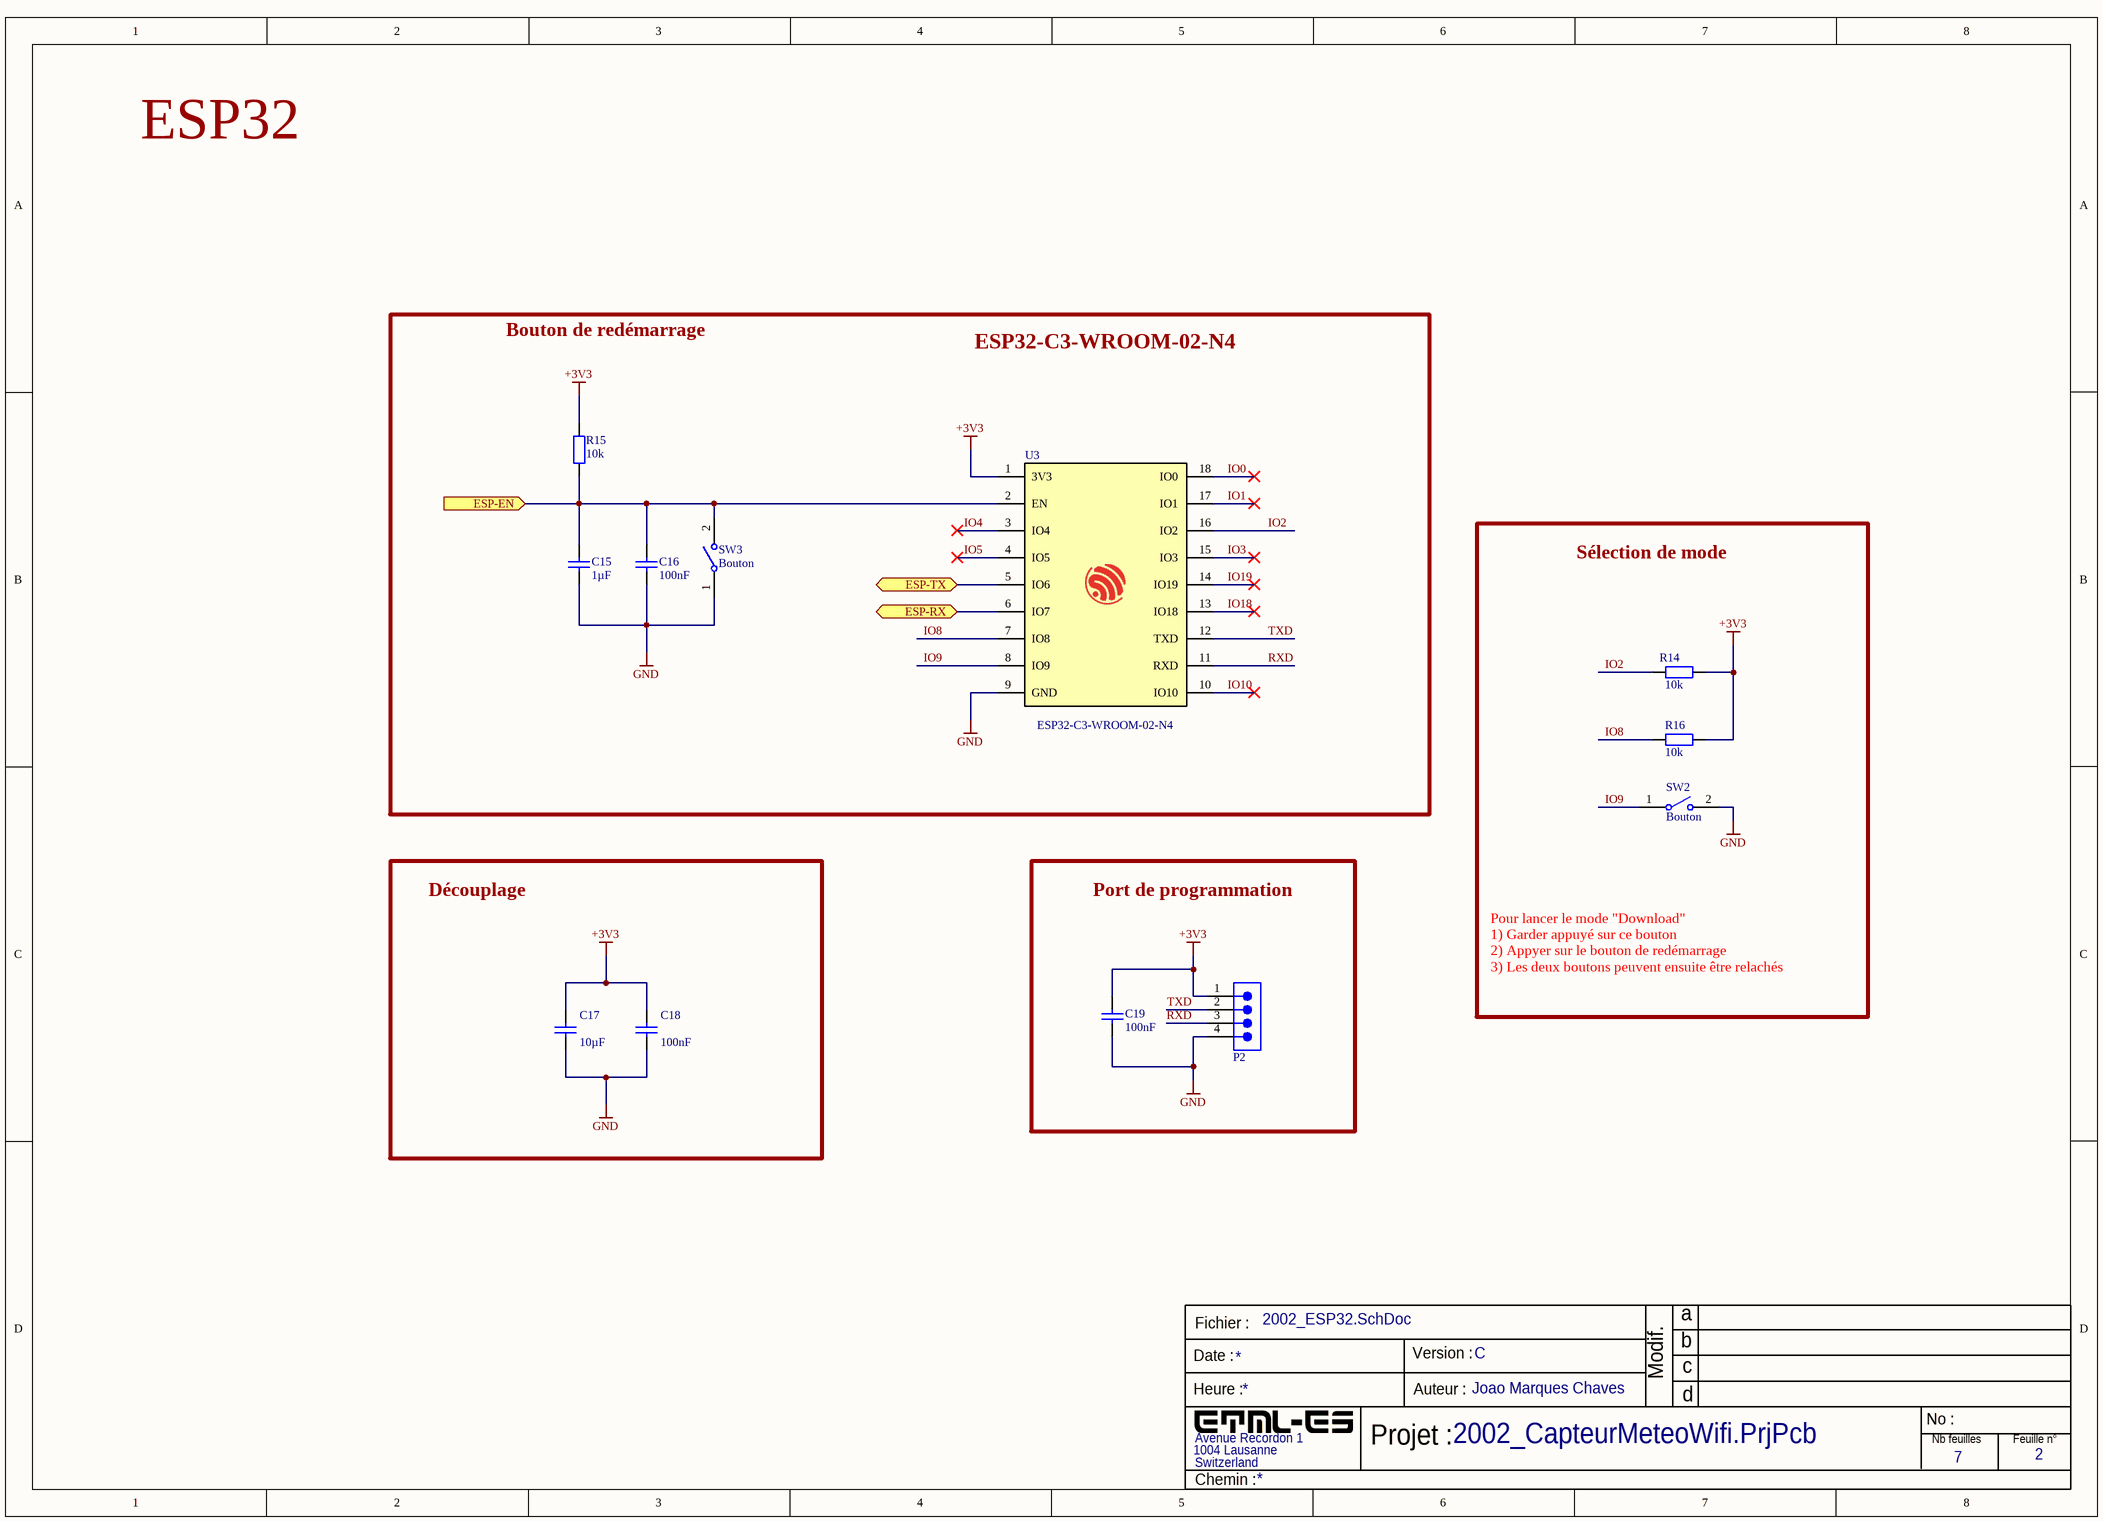
[diagram p5: 2002_ESP32.SchDoc]

### Parts
C15  Capacitance: 1µF  [0805]  (hidden comment: 1uF)
C16  100nF  [0805]
C17  Capacitance: 10µF  [0805]  (hidden comment: 10uF)
C18  Capacitance: 100nF  [0805]  (hidden comment: 100nF16)
C19  100nF  [0805]
P2  4 pin header  [1x4]  (value not drawn)
R14  10k  [0805]
R15  10k  [0805]
R16  10k  [0805]
SW2  Bouton  [Switch]
SW3  Bouton  [Switch]
U3  ESP32-C3-WROOM-02-N4  [MODULE_ESP32-C3-WROOM-02-H4]

### Blocks framed on the sheet
ESP32-C3-WROOM-02-N4: C15 C16 R15 SW3 U3
Sélection de mode: R14 R16 SW2
Découplage: C17 C18
Port de programmation: C19 P2

### Ports
ESP-EN (in), ESP-RX (bidir), ESP-TX (bidir)

### Nets
+3V3: C17.2 C18.2 C19.2 P2.1 R14.1 R15.1 R16.2 U3.1(3V3)
GND: C15.1 C16.2 C17.1 C18.1 C19.1 P2.4 SW2.2 SW3.1 U3.9(GND)
ESP-EN: C15.2 C16.1 R15.2 SW3.2 U3.2(EN) ; port ESP-EN
ESP-RX: U3.6(IO7) ; port ESP-RX
ESP-TX: U3.5(IO6) ; port ESP-TX
IO0: U3.18(IO0)
IO1: U3.17(IO1)
IO2: R14.2 U3.16(IO2)
IO3: U3.15(IO3)
IO4: U3.3(IO4)
IO5: U3.4(IO5)
IO8: R16.1 U3.7(IO8)
IO9: SW2.1 U3.8(IO9)
IO10: U3.10(IO10)
IO18: U3.13(IO18)
IO19: U3.14(IO19)
RXD: P2.3 U3.11(RXD)
TXD: P2.2 U3.12(TXD)

### Notes on the sheet
- ESP32
- Bouton de redémarrage
- Pour lancer le mode "Download"
  1) Garder appuyé sur ce bouton
  2) Appyer sur le bouton de redémarrage
  3) Les deux boutons peuvent ensuite être relachés
- Fichier :
- a
- Date :
- Heure :
- Version :
- Auteur :
- Modif.
- b
- c
- d
- Projet :
- No :
- Nb feuilles
- Feuille n°
- Chemin :

### Library data of the parts
C15 = 885012207022: Capacitor smd; Manufacturer: Wurth Elektronik; Match Code: WCAP-CSGP; Capacitance Tolerance: +/-10%; Ceramic Type: X7R; Dissipation Factor: 5%; Insulation Resistance: 0.5GΩ; Rated Voltage (DC): 10V; Technical Reference: X7R0805105K010DFCT10000; Manufacturer Part Number: 885012207022; Category: Multilayer Ceramic Chip Capacitors; ComponentLink1Description: Website Link; ComponentLink1URL: https://www.we-online.com/redexpert/article/885012207022?ad; ComponentLink2Description: Datasheet Link; ComponentLink2URL: https://www.we-online.com/redexpert/spec/885012207022?ad; Mount: Surface Mount; Operating Temperature Max: 125°C; Operating Temperature Min: -55°C; Packaging: Tape and Reel; Case/Size Code: 0805; Length: 2mm; Width: 1.25mm; Height: 1.25mm
C16 C18 C19 = 885012207016: as C8 on sheet 2002_PIC32; Manufacturer Part Number: 885012207016; Category: Multilayer Ceramic Chip Capacitors; ComponentLink1Description: Website Link; ComponentLink1URL: https://www.we-online.com/redexpert/article/885012207016?ad; ComponentLink2Description: Datasheet Link; ComponentLink2URL: https://www.we-online.com/redexpert/spec/885012207016?ad; Mount: Surface Mount; Operating Temperature Max: 125°C; Operating Temperature Min: -55°C; Packaging: Tape and Reel; Case/Size Code: 0805; Length: 2mm; Width: 1.25mm; Height: 0.8mm
  C16 C19: Capacitance: 100nF
C17 = 885012107004: Capacitor smd; Manufacturer: Wurth Elektronik; Match Code: WCAP-CSGP; Capacitance Tolerance: +/-20%; Ceramic Type: X5R; Dissipation Factor: 15%; Insulation Resistance: 0.01GΩ; Rated Voltage (DC): 6.3V; Technical Reference: X5R0805106M6R3DFCT10000; Manufacturer Part Number: 885012107004; Category: Multilayer Ceramic Chip Capacitors; ComponentLink1Description: Website Link; ComponentLink1URL: https://www.we-online.com/redexpert/article/885012107004?ad; ComponentLink2Description: Datasheet Link; ComponentLink2URL: https://www.we-online.com/redexpert/spec/885012107004?ad; Mount: Surface Mount; Operating Temperature Max: 85°C; Operating Temperature Min: -55°C; Packaging: Tape and Reel; Case/Size Code: 0805; Length: 2mm; Width: 1.25mm; Height: 1.25mm
P2 = 61300411121: WR-PHD Pin Header, THT, Vertical, pitch 2.54mm, 1 Row, 4P; Manufacturer: Wurth Elektronik; Contact Resistance: 20mΩ; Rated Current: 3A; Working Voltage: 250V; Withstanding Voltage: 500V; ComponentLink1Description: distributeur; ComponentLink1URL: https://eu.mouser.com/ProductDetail/Wurth-Elektronik/61300411121?qs=PhR8RmCirEYQcLLqXD8rAA%3D%3D; ComponentLink2Description: Datasheet; ComponentLink2URL: https://www.we-online.com/components/products/datasheet/61300411121.pdf; Manufacturer Part Number: 61300411121; Category: Board-to-Board Connectors; Match Code: WR-PHD; Mount: Through Hole; Operating Temperature Max: 105°C; Operating Temperature Min: -40°C; Packaging: Bag; Gender: Pin Header; Number of Pins: 4; Number of Rows: 1; Orientation: Vertical; Pitch: 2.54mm
R14-R16 = RES-0805: SMD Resistor; Resistance: 10k
SW2 SW3 = 434121050836: as SW1 on sheet 2002_PIC32; Manufacturer Part Number: 434121050836; Category: Tact Switches; Match Code: WS-TASV; ComponentLink1Description: Website Link; ComponentLink1URL: https://www.we-online.com/redexpert/article/434121050836?ad; ComponentLink2Description: Datasheet Link; ComponentLink2URL: https://www.we-online.com/redexpert/spec/434121050836?ad; Mount: Surface Mount; Operating Temperature Max: 85°C; Operating Temperature Min: -40°C; Packaging: Tape and Reel; Length: 6mm; Width: 3.5mm; Height: 5mm; Contact Material: Stainless Steel; Contact Plating: Silver; Terminal Material: Copper Alloy; Terminal Plating: Silver; ComponentLink3Description: distributeur; ComponentLink3URL: https://eu.mouser.com/ProductDetail/Wurth-Elektronik/434121050836?qs=wr8lucFkNMVxMSmJWja3%2Fg%3D%3D; ComponentLink4Description: Datasheet; ComponentLink4URL: https://www.we-online.com/components/products/datasheet/434121050836.pdf
U3 = ESP32-C3-WROOM-02-N4: WiFi Modules (802.11) (Engineering Samples) SMD module, ESP32-C3, 4MB SPI flash, PCB antenna, -40 C +85 C; Manufacturer_Name: Espressif Systems; Geometry.Height: 3.35mm; Manufacturer_Part_Number: ESP32-C3-WROOM-02-N4; Mouser Part Number: 356-ESP32C3WROOM02N4; distributeur: https://www.mouser.co.uk/ProductDetail/Espressif-Systems/ESP32-C3-WROOM-02-N4?qs=stqOd1AaK7%2FqjTZKEOgfUg%3D%3D; Arrow Part Number: *; Arrow Price/Stock: *; Datasheet Link: https://www.mouser.ch/datasheet/2/891/Espressif_ESP32_C3_WROOM_02-2006871.pdf; ComponentLink1Description: Datasheet; ComponentLink1URL: https://www.mouser.ch/datasheet/2/891/Espressif_Systems_04082021_ESP32_C3_WROOM_02-2295851.pdf

## Sheet 2002_Pile-Accu.SchDoc
size A3; Author: Joao Marques Chaves; Organization: ETML-ES; Address1: Avenue Recordon 1; Address2: 1004 Lausanne; Address3: Switzerland; SheetNumber: 7; SheetTotal: 7; Version: C
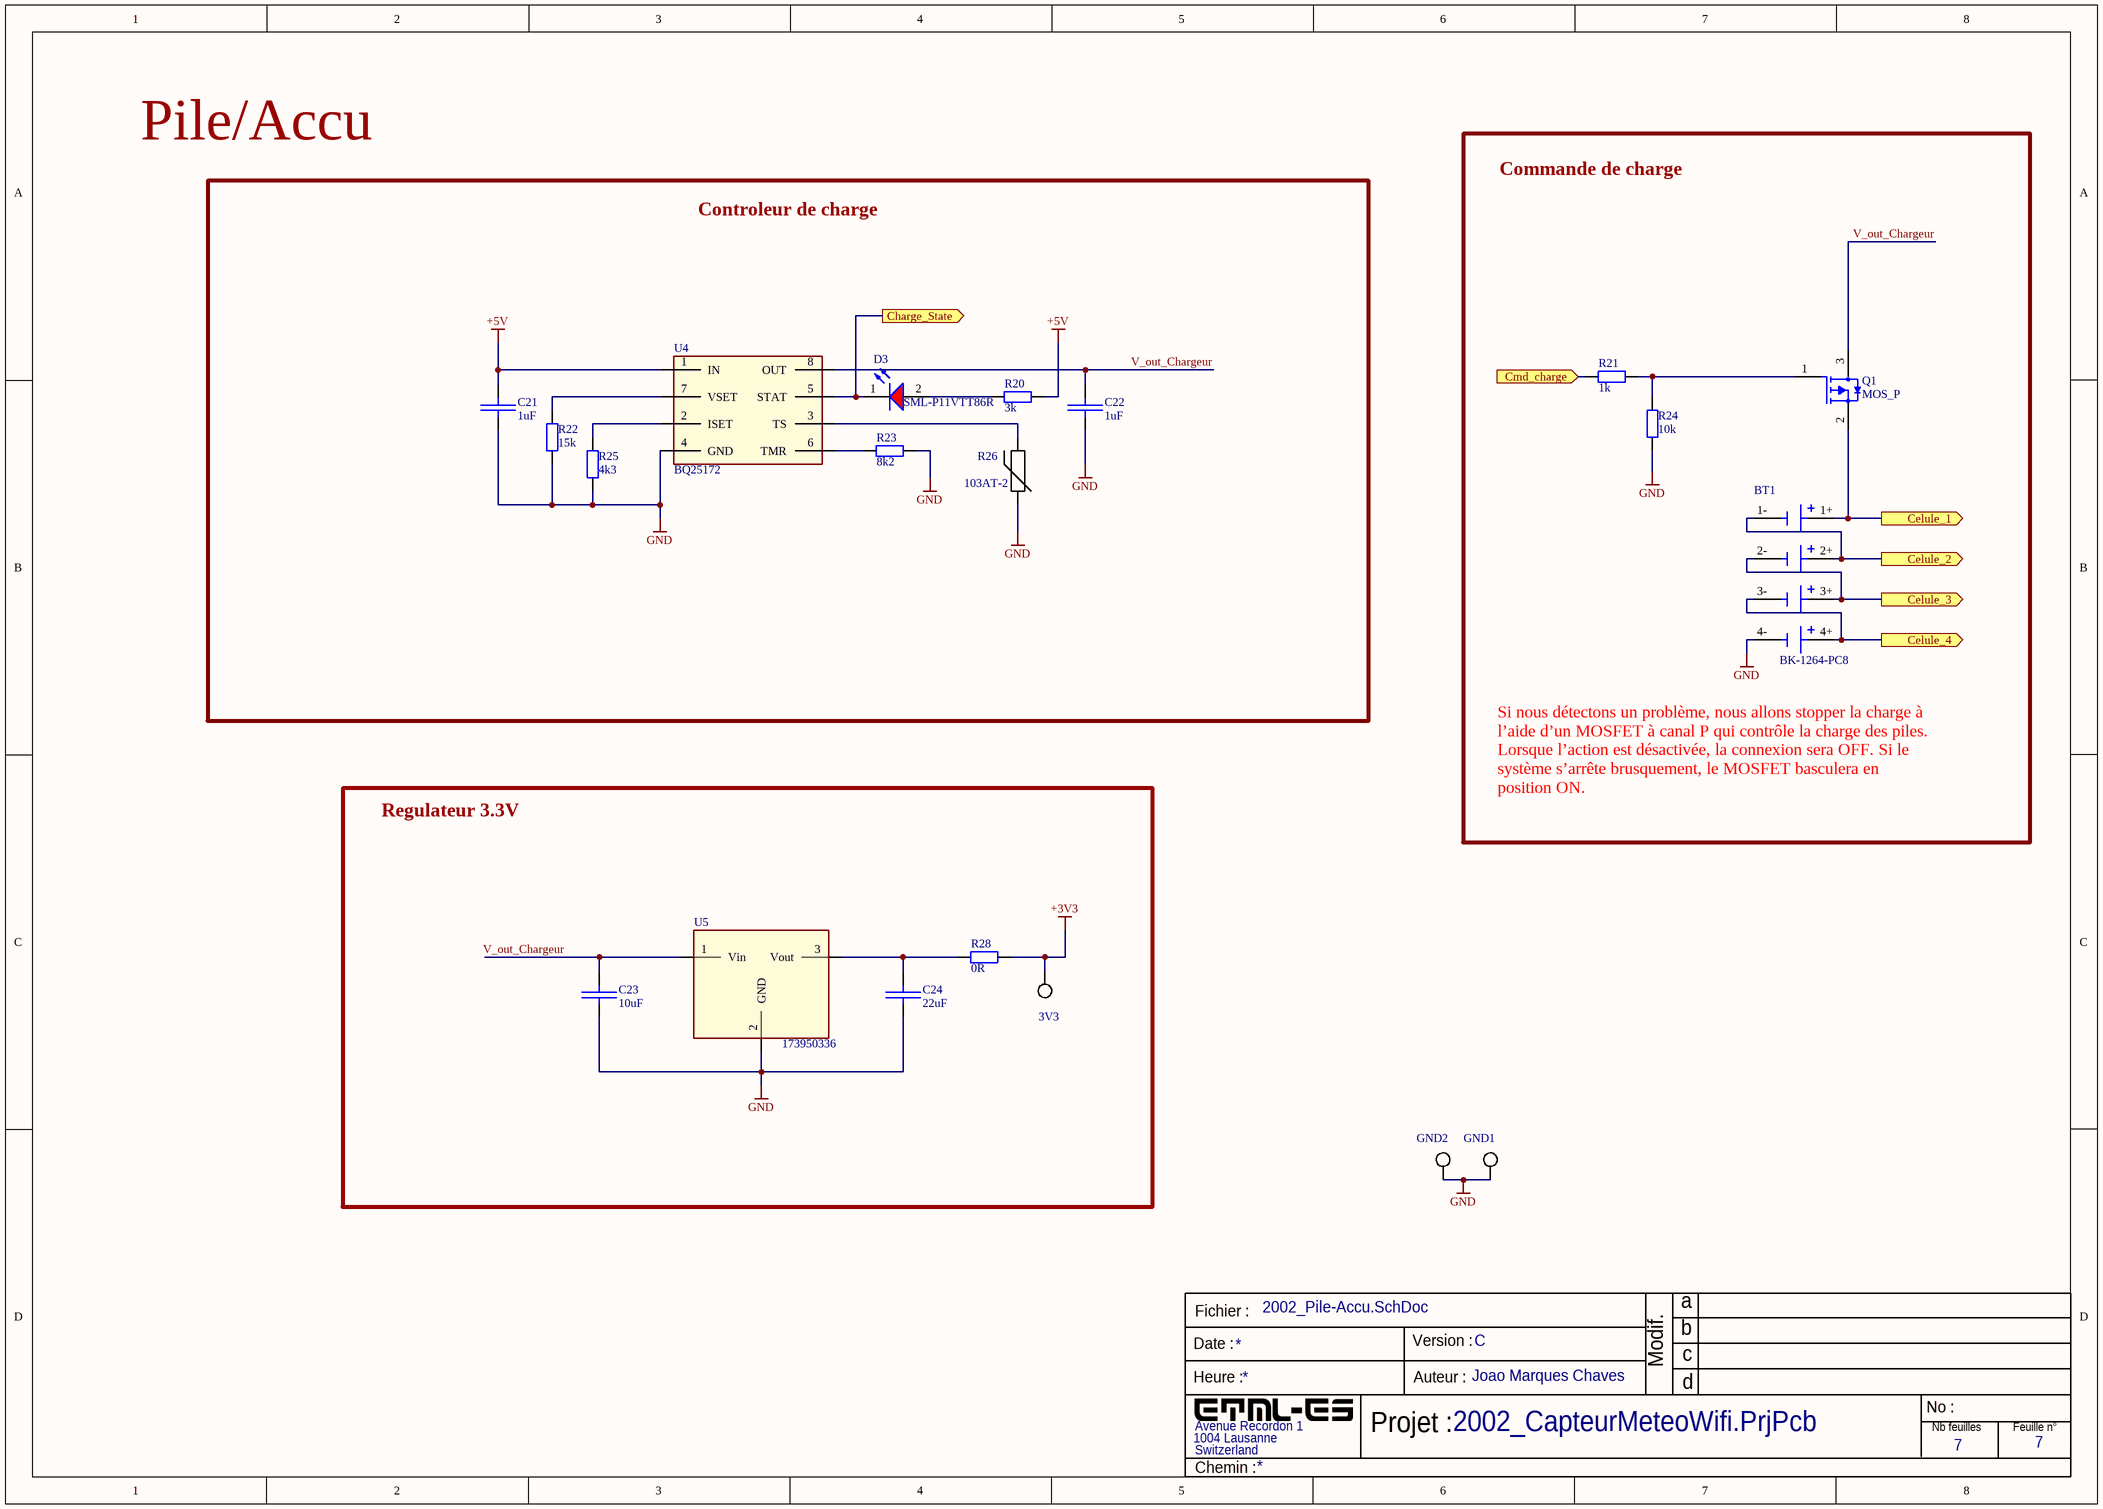
[diagram p6: 2002_Pile-Accu.SchDoc]

### Parts
3V3  5019  [TESTPOINT_SMD]  (value not drawn)
BT1  BK-1264-PC8  [BAT_BK-1264-PC8]
C21  1uF  [0805]
C22  1uF  [0805]
C23  10uF  [0805]
C24  22uF  [0805]
D3  SML-P11VTT86R  [LED_SML-P11VTT86R]
GND1  5019  [TESTPOINT_SMD]  (value not drawn)
GND2  5019  [TESTPOINT_SMD]  (value not drawn)
Q1  MOS_P  [SI5618-TP]
R20  value 3k  [0805]  (hidden comment: 3k2)
R21  1k  [0805]
R22  15k  [0805]
R23  8k2  [0805]
R24  10k  [0805]
R25  4k3  [0805]
R26  103AT-2  [103AT51PFT]
R28  0R  [0805]
U4  BQ25172  [BQ25172DSGR]
U5  173950336  [173950336]

### Blocks framed on the sheet
Commande de charge: BT1 Q1 R21 R24
Controleur de charge: C21 C22 D3 R20 R22 R23 R25 R26 U4
Regulateur 3.3V: 3V3 C23 C24 R28 U5

### Ports
Celule_1 (out), Celule_2 (out), Celule_3 (out), Celule_4 (out), Charge_State (out), Cmd_charge (in)

### Nets
+3V3: 3V3.1 R28.1
+5V: C21.1 R20.1 U4.1(IN)
GND: BT1.4- C21.2 C22.2 C23.2 C24.2 GND1.1 GND2.1 R22.1 R23.1 R24.1 R25.1 R26.2 U4.4(GND) U5.2(GND)
Celule_1: BT1.1+ Q1.2(S) ; port Celule_1
Celule_2: BT1.1- BT1.2+ ; port Celule_2
Celule_3: BT1.2- BT1.3+ ; port Celule_3
Celule_4: BT1.3- BT1.4+ ; port Celule_4
Charge_State: D3.1(K) U4.5(STAT) ; port Charge_State
Cmd_charge: R21.2 ; port Cmd_charge
V_out_Chargeur: C22.1 C23.1 Q1.3(D) U4.8(OUT) U5.1(Vin)
NetC24_1: C24.1 R28.2 U5.3(Vout)
NetD3_2: D3.2(A) R20.2
NetQ1_1: Q1.1(G) R21.1 R24.2
NetR22_2: R22.2 U4.7(VSET)
NetR23_2: R23.2 U4.6(TMR)
NetR25_2: R25.2 U4.2(ISET)
NetR26_1: R26.1 U4.3(TS)

### Notes on the sheet
- Pile/Accu
- Si nous détectons un problème, nous allons stopper la charge à l’aide d’un MOSFET à canal P qui contrôle la charge des piles. Lorsque l’action est désactivée, la connexion sera OFF. Si le système s’arrête brusquement, le MOSFET basculera en position ON.
- Fichier :
- a
- Date :
- Heure :
- Version :
- Auteur :
- Modif.
- b
- c
- d
- Projet :
- No :
- Nb feuilles
- Feuille n°
- Chemin :

### Library data of the parts
3V3 GND1 GND2 = TESTPOINT: Test point smd
BT1 = BK-1264-PC8: Battery Holder (Open) AAA 4 Cell PC Pin; Package: None; Price: None; Value: *; MP: BK-1264-PC8; Availability: Unavailable
C21-C24 = Condensator: Capacitor smd
  C21 C22: Value: 1uF
  C23: Value: 10uF
  C24: Value: 22uF
D3 = 150080SS75000: WL-SMCW Mono-color Chip LED Waterclear, size 0805, Super Red, 1.9V, 140°; Manufacturer: Wurth Elektronik; Case/Size Code: 0805; Chip Technology: AlInGaP; Dominant Wavelength: 630nm; Luminous Intensity: 60mcd; Peak Wavelength: 645nm; Manufacturer Part Number: 150080SS75000; Category: Signal LEDs; Match Code: WL-SMCW; ComponentLink1Description: Website Link; ComponentLink1URL: https://www.we-online.com/redexpert/article/150080SS75000?ad; ComponentLink2Description: Datasheet Link; ComponentLink2URL: https://www.we-online.com/redexpert/spec/150080SS75000?ad; Mount: Surface Mount; Operating Temperature Max: 85°C; Operating Temperature Min: -40°C; Packaging: Tape and Reel; Length: 2mm; Width: 1.25mm; Height: 0.7mm; Emitting Color: Super Red; Forward Voltage: 1.9V; Viewing Angle: 140°
R20 R22-R25 R28 = Res2_1: Resistor smd; Published: 8-Jun-2000; LatestRevisionDate: 17-Jul-2002; LatestRevisionNote: Re-released for DXP Platform.; PackageReference: AXIAL-0.4; Publisher: Altium Limited; PackageDescription: Axial Device, Thru-Hole; 2 Leads; 0.4 in Pin Spacing
  R22: Value: 15k
  R23: Value: 8k2
  R24: Value: 10k
  R25: Value: 4k3
  R28: Value: 0R
R21 = Res2: Resistor smd; Published: 8-Jun-2000; LatestRevisionDate: 17-Jul-2002; LatestRevisionNote: Re-released for DXP Platform.; PackageReference: AXIAL-0.4; Publisher: Altium Limited; PackageDescription: Axial Device, Thru-Hole; 2 Leads; 0.4 in Pin Spacing; Value: 1k
R26 = 103AT-2: thermistor; ComponentLink1Description: distributeur; ComponentLink1URL: https://www.mouser.ch/ProductDetail/Semitec/103AT-2?qs=wgO0AD0o1vvcDzsKguD%252Bew%3D%3D; ComponentLink2Description: Datasheet; ComponentLink2URL: https://www.mouser.ch/datasheet/2/362/semitec_atthermistor-1202913.pdf
U4 = BQ25172: Linear Battery Charger for 1- to 6-Cell NiMH Batteries; ComponentLink1Description: Datasheet; ComponentLink1URL: https://www.ti.com/lit/ds/symlink/bq25172.pdf?ts=1723181325396&ref_url=https%253A%252F%252Fwww.ti.com%252Fproduct%252FBQ25172%253Fbm-verify%253DAAQAAAAJ_____wF_Ss5Mx06KPY5wuR_GF74KlZYjgF463_PIRlVM87DaDimX8hD-z5276A7B4TIBZX0NkuoKNaHBi_BIZQjDV1LkEa4XRsG8u1VR9BofVYTDsa9KgQteCP0sYfXOG9XXdaIOCU4KV78p5I1mhsmEOew16_50esNWIwSvDA3hHiIVf5i8-2P7KThDd6J7Jl4hgoO4l1TC-NrfqnpFAYdm-pJ9AU9Ln766c7PomkWTcyYO1H9qEKlA_yTBE6jjSW5w3O45YuJnRCFg0pGldNq3fYTHPtlSH1bEqJ5IycH_AYGXDBQnkfkbRS1wfv-ZE-mPqIHZclsKyH4WNfY1MM8vqArrSoJICNJdn9XZRI90A8FZbu-ed-N5SM80SaNCRuUgfrfBEdcsRTe5V1SxlZb-1CspPmd3; ComponentLink2Description: distributeur; ComponentLink2URL: https://www.mouser.ch/ProductDetail/Texas-Instruments/BQ25172DSGR?qs=tlsG%2FOw5FFgckLJXIVn4PA%3D%3D
U5 = 173950336: DC DC CONVERTER 3.3V; ComponentLink1Description: distributeur; ComponentLink1URL: https://www.mouser.ch/ProductDetail/Wurth-Elektronik/173950336?qs=d0WKAl%252BL4KZw6hIvUkPbpg%3D%3D; N° de fab. :: 173950336; N° Mouser :: 710-173950336; ComponentLink2Description: Datasheet; ComponentLink2URL: https://www.we-online.com/components/products/datasheet/173950336.pdf
Q1 = MOS_P: ComponentLink1Description: New link; ComponentLink1URL: https://www.mouser.ch/ProductDetail/Micro-Commercial-Components-MCC/SI5618-TP?qs=GedFDFLaBXHJp%2FsrOFCJpg%3D%3D

## Nets that join several sheets
+3V3: 2002_PIC32 (8 pins), 2002_RTC (C14.1 N1.5 R12.1 R13.1), 2002_Capteur_Indication (C20.1 D2.1 J1.2), 2002_ESP32 (8 pins), 2002_Pile-Accu (3V3.1 R28.1)
+5V: 2002_USB (C5.1 L1.1 R29.2 V_USB.1), 2002_Pile-Accu (C21.1 R20.1 U4.1)
GND: 2002_USB (12 pins), 2002_PIC32 (11 pins), 2002_RTC (5 pins), 2002_Capteur_Indication (C20.2 J1.1), 2002_ESP32 (9 pins), 2002_Pile-Accu (14 pins)
Celule_1: 2002_SchemaBloc (V_Pile_Accu.1), 2002_PIC32 (U2.10), 2002_Pile-Accu (BT1.1+ Q1.2)
Celule_2: 2002_PIC32 (U2.11), 2002_Pile-Accu (BT1.1- BT1.2+)
Celule_3: 2002_PIC32 (U2.14), 2002_Pile-Accu (BT1.2- BT1.3+)
Celule_4: 2002_PIC32 (U2.15), 2002_Pile-Accu (BT1.3- BT1.4+)
Charge_State: 2002_PIC32 (U2.25), 2002_Pile-Accu (D3.1 U4.5)
Cmd_charge: 2002_PIC32 (U2.26), 2002_Pile-Accu (R21.2)
ESP-EN: 2002_SchemaBloc (ESP_EN.1), 2002_PIC32 (U2.3), 2002_ESP32 (5 pins)
ESP-RX: 2002_SchemaBloc (ESP_RX.1), 2002_PIC32 (U2.4), 2002_ESP32 (U3.6)
ESP-TX: 2002_SchemaBloc (ESP_TX.1), 2002_PIC32 (U2.5), 2002_ESP32 (U3.5)
LED_RGB_B: 2002_PIC32 (U2.43), 2002_Capteur_Indication (R19.1)
LED_RGB_G: 2002_PIC32 (U2.42), 2002_Capteur_Indication (R18.1)
LED_RGB_R: 2002_PIC32 (U2.41), 2002_Capteur_Indication (R17.1)
RTC_INT: 2002_SchemaBloc (RTC_INT.1), 2002_PIC32 (U2.8), 2002_RTC (N1.6 R12.2)
RTC_SCL: 2002_SchemaBloc (RTC_SCL.1), 2002_PIC32 (U2.44), 2002_RTC (N1.7)
RTC_SDA: 2002_SchemaBloc (RTC_SDA.1), 2002_PIC32 (U2.1), 2002_RTC (N1.8 R13.2)
SENS INT: 2002_SchemaBloc (SENS_INT.1), 2002_PIC32 (U2.33), 2002_Capteur_Indication (J1.5)
SENS_SCL: 2002_SchemaBloc (SENS_SCL.1), 2002_PIC32 (U2.24), 2002_Capteur_Indication (J1.4)
SENS_SDA: 2002_SchemaBloc (SENS_SDA.1), 2002_PIC32 (U2.23), 2002_Capteur_Indication (J1.3)
USB_CTS: 2002_SchemaBloc (USB_CTS.1), 2002_USB (R5.1 U1.6), 2002_PIC32 (U2.20)
USB_RTS: 2002_SchemaBloc (USB_RTS.1), 2002_USB (R4.1 U1.2), 2002_PIC32 (U2.31)
USB_RX: 2002_SchemaBloc (USB_TX.1), 2002_USB (R3.1 U1.4), 2002_PIC32 (U2.19)
USB_TX: 2002_SchemaBloc (USB_RX.1), 2002_USB (R2.1 U1.1), 2002_PIC32 (U2.30)